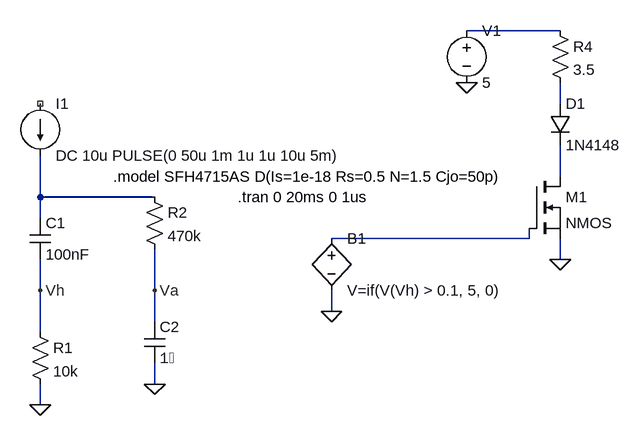
[diagram p0: schematic peak_hold_pulse_stretcher_draft2.asc]
peak_hold_pulse_stretcher_draft2.asc, the LTspice schematic file:
Version 4
SHEET 1 1076 808
WIRE 976 -80 832 -80
WIRE 976 32 976 0
WIRE 976 144 976 96
WIRE 176 176 176 112
WIRE 352 176 176 176
WIRE 176 208 176 176
WIRE 928 240 928 224
WIRE 928 240 624 240
WIRE 976 272 976 240
WIRE 176 320 176 272
WIRE 352 320 352 256
WIRE 624 352 624 320
WIRE 352 368 352 320
WIRE 176 384 176 320
WIRE 352 464 352 432
WIRE 176 496 176 464
FLAG 176 496 0
FLAG 352 464 0
FLAG 176 320 Vh
FLAG 352 320 Va
FLAG 976 272 0
FLAG 624 352 0
FLAG 832 0 0
SYMBOL current 176 32 R0
SYMATTR InstName I1
SYMATTR Value DC 10u PULSE(0 50u 1m 1u 1u 10u 5m)
SYMBOL cap 160 208 R0
SYMATTR InstName C1
SYMATTR Value 100nF
SYMBOL res 160 368 R0
SYMATTR InstName R1
SYMATTR Value 10k
SYMBOL res 336 160 R0
SYMATTR InstName R2
SYMATTR Value 470k
SYMBOL cap 336 368 R0
SYMATTR InstName C2
SYMATTR Value 1�
SYMBOL bv 624 224 R0
SYMATTR InstName B1
SYMATTR Value V=if(V(Vh) > 0.1, 5, 0)
SYMBOL nmos 928 144 R0
SYMATTR InstName M1
SYMBOL diode 960 32 R0
SYMATTR InstName D1
SYMATTR Value 1N4148
SYMBOL Res 960 -96 R0
SYMATTR InstName R4
SYMATTR Value 3.5
SYMBOL Voltage 832 -96 R0
SYMATTR InstName V1
SYMATTR Value 5
TEXT 480 176 Left 2 !.tran 0 20ms 0 1us
TEXT 288 144 Left 2 !.model SFH4715AS D(Is=1e-18 Rs=0.5 N=1.5 Cjo=50p)

The netlist it stands for:
* peak_hold_pulse_stretcher_draft2.asc
I1 NC_01 N004 DC 10u PULSE(0 50u 1m 1u 1u 10u 5m)
C1 N004 Vh 100nF
R1 Vh 0 10k
R2 N004 Va 470k
C2 Va 0 1�
B1 N005 0 V=if(V(Vh) > 0.1, 5, 0)
M1 N003 N005 0 0 NMOS
D1 N002 N003 1N4148
R4 N001 N002 3.5
V1 N001 0 5
.model D D
.lib standard.dio
.model NMOS NMOS
.model PMOS PMOS
.lib standard.mos
.tran 0 20ms 0 1us
.model SFH4715AS D(Is=1e-18 Rs=0.5 N=1.5 Cjo=50p)
.backanno
.end